# Altium project BATTERY.PrjPcb
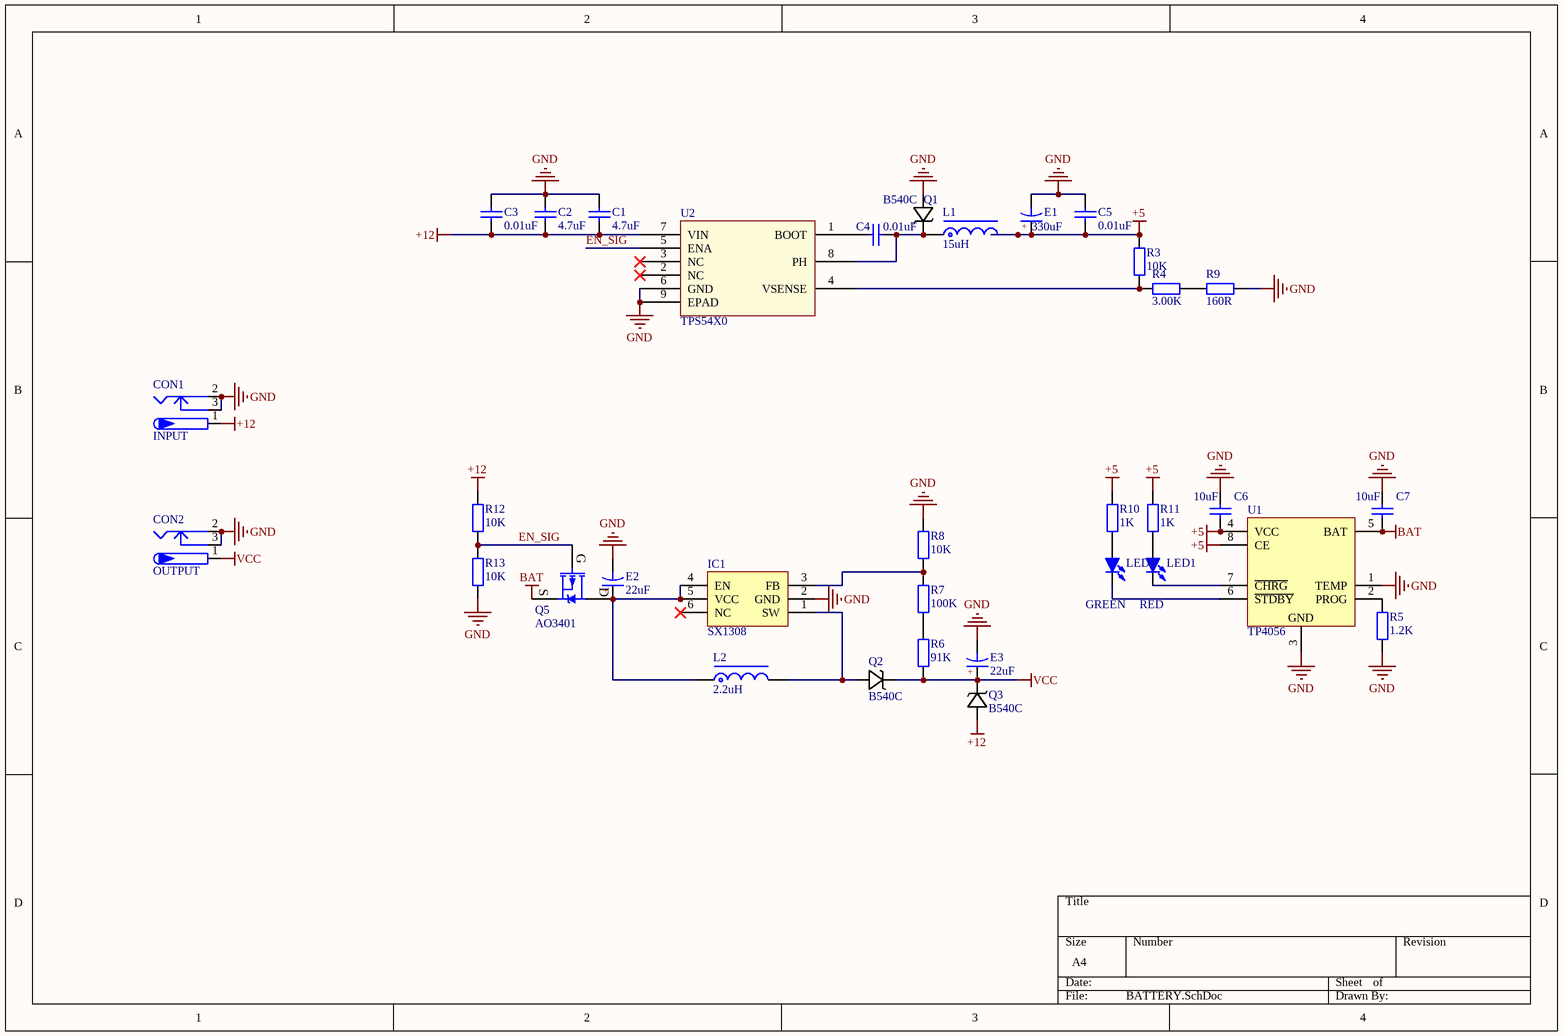
[diagram p0: BATTERY.SchDoc]
1 sheet, 34 parts. Net scope: global (net labels, ports and power ports of the same name join across sheets).
Board file: BATTERY.PcbDoc

## Sheet BATTERY.SchDoc
size A4; SheetNumber: 1; SheetTotal: 1

### Parts
C1  4.7uF  [C0603_M]
C2  4.7uF  [C0603_M]
C3  0.01uF  [C0603_M]
C4  0.01uF  [C0603_M]
C5  0.01uF  [C0603_M]
C6  10uF  [C0603_M]
C7  10uF  [C0603_M]
CON1  INPUT  [DC-005]
CON2  OUTPUT  [DC-005]
E1  330uF  [CE D(6.3*7.7)]
E2  22uF  [CE D(6.3*7.7)]
E3  22uF  [CE D(6.3*7.7)]
IC1  SX1308  [SOT23-6N]
L1  15uH  [L-SMD-0420]
L2  2.2uH  [L-SMD-0420]
LED1  RED  [LED0805_G]
LED2  GREEN  [LED0805_G]
Q1  B540C  [DO-214AB]
Q2  B540C  [DO-214AB]
Q3  B540C  [DO-214AB]
Q5  AO3401  [SOT23-3N]
R3  10K  [R0603_M]
R4  3.00K  [R0603_M]
R5  1.2K  [R0603_M]
R6  91K  [R0603_M]
R7  100K  [R0603_M]
R8  10K  [R0603_M]
R9  160R  [R0603_M]
R10  1K  [R0603_M]
R11  1K  [R0603_M]
R12  10K  [R0603_M]
R13  10K  [R0603_M]
U1  TP4056  [SOIC-8_EP]
U2  TPS54X0  [SOIC-8_EP]

### Nets
+5: C5.2 C6.2 E1.1 L1.2 R3.2 R10.1 R11.1 U1.4(VCC) U1.8(CE)
+12: C1.2 C2.2 C3.2 CON1.1 Q3.1 R12.1 U2.7(VIN)
BAT: C7.2 Q5.2(S) U1.5(BAT)
GND: C1.1 C2.1 C3.1 C5.1 C6.1 C7.1 CON1.2 CON1.3 CON2.2 CON2.3 E1.2 E2.2 E3.2 IC1.2(GND) Q1.1 R5.1 R8.2 R9.1 R13.2 U1.1(TEMP) U1.3(GND) U2.6(GND) U2.9(EPAD)
VCC: CON2.1 E3.1 Q2.2 Q3.2 R6.1
EN_SIG: Q5.1(G) R12.2 R13.1 U2.5(ENA)
NetC4_1: C4.1 U2.1(BOOT)
NetC4_2: C4.2 L1.1 Q1.2 U2.8(PH)
NetE2_1: E2.1 IC1.4(EN) IC1.5(VCC) L2.1 Q5.3(D)
NetIC1_1: IC1.1(SW) L2.2 Q2.1
NetIC1_3: IC1.3(FB) R7.2 R8.1
NetLED1_1: LED1.1(A) R11.2
NetLED1_2: LED1.2(K) U1.7(~{CHRG})
NetLED2_1: LED2.1(A) R10.2
NetLED2_2: LED2.2(K) U1.6(~{STDBY})
NetR3_1: R3.1 R4.2 U2.4(VSENSE)
NetR4_1: R4.1 R9.2
NetR5_2: R5.2 U1.2(PROG)
NetR6_2: R6.2 R7.1

Not connected (* = marked no-connect by the designer): IC1 6(NC)*; U2 2(NC)* 3(NC)*

### Notes on the sheet
- (in symbol CE_SMD) +

### Library data of the parts
C1-C7 = C: 贴片电容/MLCC电容; BOM名称: 无极性贴片电容; 联系卖家，免费查找封装: 唯一出售店铺网址https://shop463601444.taobao.com
CON1 CON2 = P-DC: 低压电源接口; BOM名称: DC电源接口; 联系卖家 免费技术支持: 封装库来自淘宝卖家ID：黄晶宝石
E1-E3 = CE_SMD: 贴片电解电容; 联系卖家，免费查找封装: 唯一出售店铺网址https://shop463601444.taobao.com; BOM名称: 贴片电解电容
IC1 = SX1308: 可调2A升压芯片; BOM名称: 可调升压芯片; 封装库来自淘宝卖家ID：黄晶宝石: 其他店铺购入的买家，请立即申请退款，本店现金奖励20~1000元
L1 L2 = L-Molding Choke: 一体成型电感; 联系卖家，免费查找封装: 唯一出售店铺网址https://shop463601444.taobao.com; BOM名称: 一体成型电感
LED1 LED2 = LED-SMD: 贴片LED; 封装库来自淘宝卖家ID：黄晶宝石: 其他店铺购入均为盗版封装库，请立即申请退款，本店现金奖励20~200元; BOM名称: 贴片LED
Q1-Q3 = B540X
Q5 = AO3401: P沟道 30V/4.2A; BOM名称: 场效应管; 8元以下特价购入的买家: 还可以联系卖家远程指导AD软件使用; 参数: P沟道 30V/4.2A
R3-R13 = R: 贴片电阻; 联系卖家，免费查找封装: 唯一出售店铺网址https://shop463601444.taobao.com; BOM名称: 贴片电阻
U1 = TP4056: 锂电池充电管理; 联系卖家 免费查找封装: 唯一出售店铺网址https://shop463601444.taobao.com
U2 = TPS5450